# Altium schematic sheet Schematic_MuSSAP.SchDoc
size 420 x 297 mm; SheetNumber: 1; SheetTotal: 1
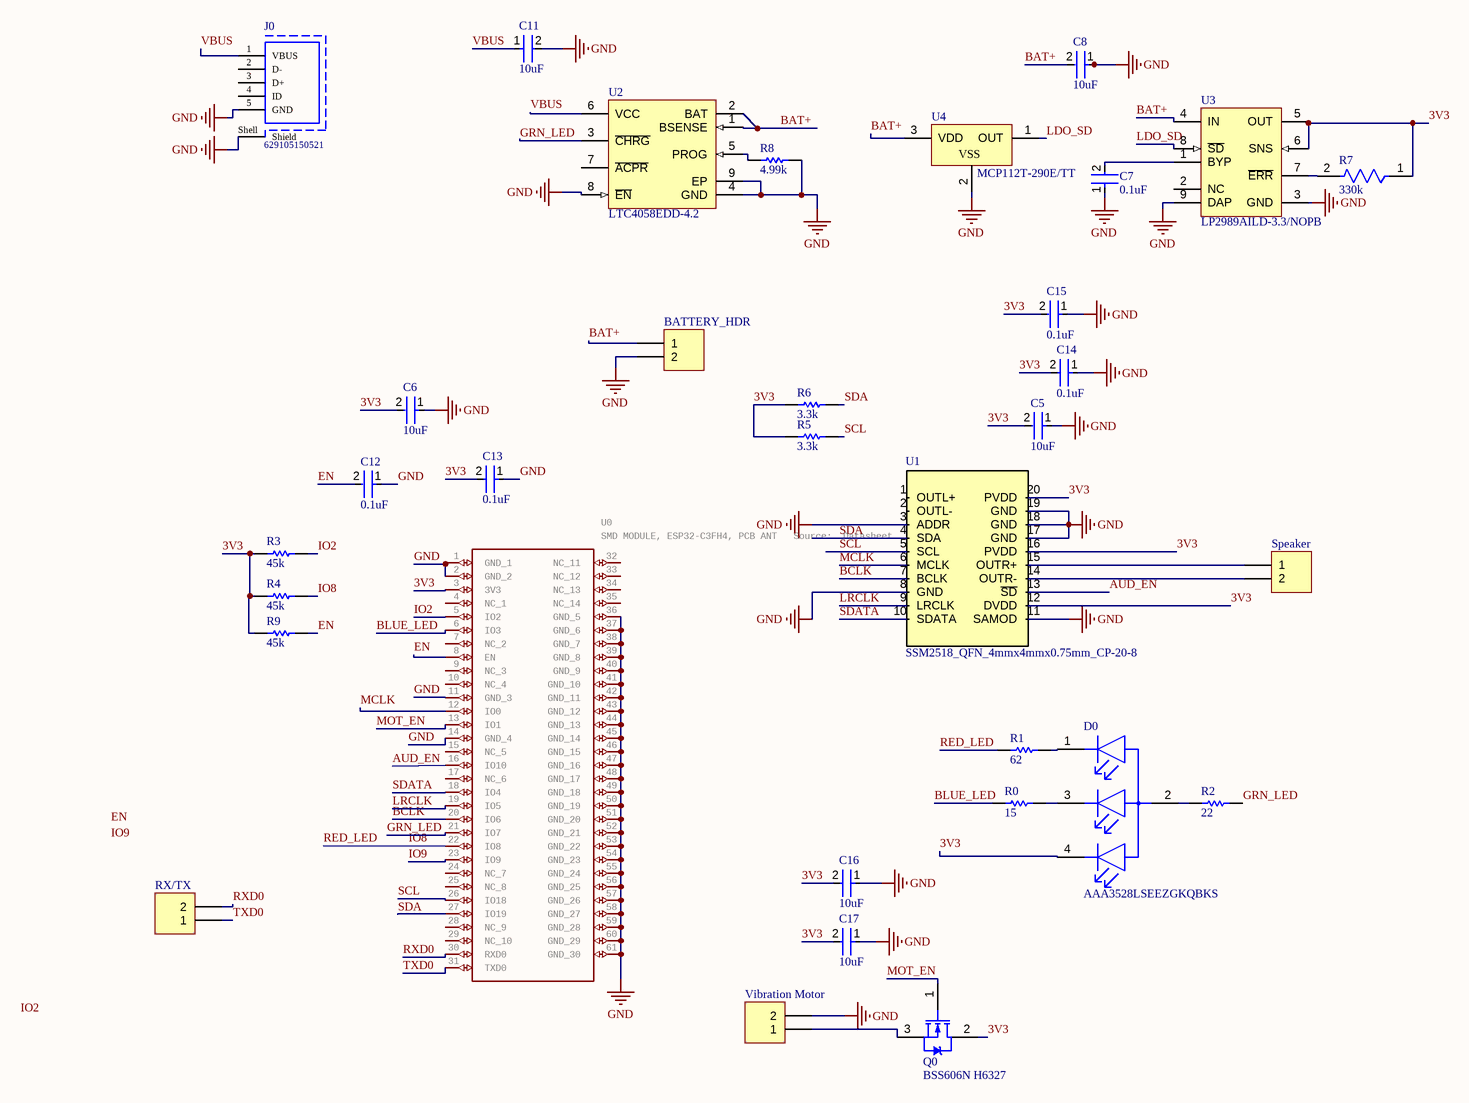
[diagram p0: Schematic_MuSSAP.SchDoc]

## Parts
BATTERY_HDR  (no value)  [HDR1X2]
C5  10uF  [FP-C0603-CG-IPC_B]
C6  10uF  [FP-C0603-CG-IPC_B]
C7  0.1uF  [FP-C0603-CG-IPC_B]
C8  10uF  [FP-C0603-CG-IPC_B]
C11  10uF  [FP-C0603-CG-IPC_B]
C12  0.1uF  [FP-C0603-CG-IPC_B]
C13  0.1uF  [FP-C0603-CG-IPC_B]
C14  0.1uF  [FP-C0603-CG-IPC_B]
C15  0.1uF  [FP-C0603-CG-IPC_B]
C16  10uF  [FP-C0603-CG-IPC_B]
C17  10uF  [FP-C0603-CG-IPC_B]
D0  AAA3528LSEEZGKQBKS  [FP-AAA3528LSEEZGKQBKS-MFG]
J0  629105150521  [629105150521]
Q0  BSS606N H6327  [INF-PG-SOT-89_N]
R0  15  [RESC1005X40X25LL05T10]
R1  62  [RESC1005X35X25ML10T10]
R2  22  [RESC1005X40X25LL05T10]
R3  45k  [RESC1005X35X25ML10T10]
R4  45k  [RESC1005X35X25ML10T10]
R5  3.3k  [RESC1005X35X25ML10T10]
R6  3.3k  [RESC1005X35X25ML10T10]
R7  330k  [FP-MCS0402-IPC_A]
R8  4.99k  [RESC1005X35X25ML10T10]
R9  45k  [RESC1005X35X25ML10T10]
RX/TX  (no value)  [HDR1X2]
Speaker  (no value)  [HDR1X2]
U0  SMD MODULE, ESP32-C3FH4, PCB ANT   Source:  Datasheet  [ESP32C3MINI1H4]
U1  SSM2518_QFN_4mmx4mmx0.75mm_CP-20-8  [QSSM2518_FN50P400X400X80_HS-21N]
U2  LTC4058EDD-4.2  [LT-DD-8_V]
U3  LP2989AILD-3.3/NOPB  [LDC08A]
U4  MCP112T-290E/TT  [SOT-23-TT3_M]
Vibration_Motor  (no value)  [HDR1X2]

## Nets
GND: BATTERY_HDR.2 C5.1 C6.1 C7.1 C8.1 C11.2 C12.1 C13.1 C14.1 C15.1 C16.1 C17.1 J0.5(GND) J0.Shell(Shield) R8.1 U0.1(GND_1) U0.2(GND_2) U0.11(GND_3) U0.14(GND_4) U0.36(GND_5) U0.37(GND_6) U0.38(GND_7) U0.39(GND_8) U0.40(GND_9) U0.41(GND_10) U0.42(GND_11) U0.43(GND_12) U0.44(GND_13) U0.45(GND_14) U0.46(GND_15) U0.47(GND_16) U0.48(GND_17) U0.49(GND_18) U0.50(GND_19) U0.51(GND_20) U0.52(GND_21) U0.53(GND_22) U0.54(GND_23) U0.55(GND_24) U0.56(GND_25) U0.57(GND_26) U0.58(GND_27) U0.59(GND_28) U0.60(GND_29) U0.61(GND_30) U1.3(ADDR) U1.8(GND) U1.11(SAMOD) U1.17(GND) U1.18(GND) U1.19(GND) U2.4(GND) U2.8(~{EN}) U2.9(EP) U3.3(GND) U3.9(DAP) U4.2(VSS) Vibration_Motor.2
3V3: C5.2 C6.2 C13.2 C14.2 C15.2 C16.2 C17.2 D0.4(BLUE_C) Q0.2(D) R3.1 R4.1 R5.1 R6.1 R7.1 R9.1 U0.3(3V3) U1.12(DVDD) U1.16(PVDD) U1.20(PVDD) U3.5(OUT) U3.6(SNS)
AUD_EN: U0.16(IO10) U1.13(~{SD})
BAT+: BATTERY_HDR.1 C8.2 U2.1(BSENSE) U2.2(BAT) U3.4(IN) U4.3(VDD)
BCLK: U0.20(IO6) U1.7(BCLK)
BLUE_LED: R0.1 U0.6(IO3)
EN: C12.2 R9.2 U0.8(EN)
GRN_LED: R2.2 U0.21(IO7) U2.3(~{CHRG})
IO2: R3.2 U0.5(IO2)
IO8: R1.1 R4.2 U0.22(IO8)  [also labelled RED_LED]
IO9: U0.23(IO9)
LDO_SD: U3.8(~{SD}) U4.1(OUT)
LRCLK: U0.19(IO5) U1.9(LRCLK)
MCLK: U0.12(IO0) U1.6(MCLK)
MOT_EN: Q0.1(G) U0.13(IO1)
RXD0: RX/TX.2 U0.30(RXD0)
SCL: R5.2 U0.26(IO18) U1.5(SCL)
SDA: R6.2 U0.27(IO19) U1.4(SDA)
SDATA: U0.18(IO4) U1.10(SDATA)
TXD0: RX/TX.1 U0.31(TXD0)
VBUS: C11.1 J0.1(VBUS) U2.6(VCC)
NetC7_2: C7.2 U3.1(BYP)
NetD0_1: D0.1(RED_C) R1.2
NetD0_2: D0.2(COMMON_ANODE) R2.1
NetD0_3: D0.3(GREEN_C) R0.2
NetQ0_3: Q0.3(S) Vibration_Motor.1
NetR7_2: R7.2 U3.7(~{ERR})
NetR8_2: R8.2 U2.5(PROG)
NetSpeaker_1: Speaker.1 U1.15(OUTR+)
NetSpeaker_2: Speaker.2 U1.14(OUTR-)

Not connected (* = marked no-connect by the designer): J0 2(D-) 3(D+) 4(ID); U0 4(NC_1) 7(NC_2) 9(NC_3) 10(NC_4) 15(NC_5) 17(NC_6) 24(NC_7) 25(NC_8) 28(NC_9) 29(NC_10) 32(NC_11) 33(NC_12) 34(NC_13) 35(NC_14); U1 1(OUTL+) 2(OUTL-); U2 7(~{ACPR}); U3 2(NC)

## Notes on the sheet
- Labels drawn without touching a wire or pin: EN, IO2, IO9
- THIS DOCUMENT AND THE DATA DISCLOSED HEREIN OR
- HEREWITH IS THE PROPERTY OF ALTIUM LIMITED AND MAY
- DWG NO:
- REVISION
- REV:
- DESCRIPTION
- DATE
- APPROVED
- BE FREELY DISTRIBUTED IN WHOLE. NO RIGHTS ARE
- RESERVED OR EXPRESS OR IMPLIED WARANTEE GIVEN.
- ENG:
- APPROVALS
- PROJECT
- DSN:
- CHK:
- REFERENCE DOCUMENTS
- PROJECT REVISION:
- TITLE
- DOCUMENT REVISION:
- DESIGN ITEM:
- BOM:
- FAB DWG:
- PCB DWG:
- ASSY DWG:
- SCALE:
- A3
- SIZE
- CAGE CODE
- FILE NAME
- DWG NO.
- SHEET
- OF
- REV

## Library data of the parts
BATTERY_HDR RX/TX Speaker Vibration_Motor = Header 2: Header, 2-Pin; LatestRevisionDate: 17-Jul-2002; LatestRevisionNote: Re-released for DXP Platform.; Publisher: Altium Limited
C5-C8 C11-C17 = CMP-2006-03069-2: CAP CER 0.1UF 25V Y5V 0603; Dissipation Factor: 7%; Capacitance: 100nF; Tolerance: 80%; Dielectric Material: Ceramic; Depth: 0.8mm; Voltage Rating (DC): 25V; Number of Pins: 2; Dielectric: Y5V; Lead Pitch: 0.7mm; Construction: Flat; Max Operating Temperature: 85°C; Voltage Rating: 25V; Lead Free: Lead Free; Case/Package: 0603; RoHS Compliant: Yes; Length: 1.6mm; Mount: Surface Mount; Thickness: 0.034inch; Radiation Hardening: No; Case Code (Metric): 1608; Packaging: Tape and Reel; Series: C; Package Quantity: 1; Height: 0.8mm; Min Operating Temperature: -30°C; Termination: SMD/SMT; Width: 0.031inch; Case Code (Imperial): 0603; REACH SVHC: No SVHC; Voltage: 25V
D0 = CMP-44529-000043-1: LED RGB CLEAR 4SMD; Dominant Wavelength: 465nm; Test Current: 2mA; Color: Blue; Forward Voltage: 2.7V; Viewing Angle: 120°; Luminous Intensity: 30mcd; Lens Color: Colorless; Case/Package: PLCC; Packaging: Tape and Reel; Number of Pins: 4; Width: 2.8mm; Lens Transparency: Clear; Mount: Surface Mount; Height: 2.1mm; Length: 3.2mm
J0 = CMP-1502-03252-1: Micro USB 2.0 Type B Receptacle WR-COM, Horizontal, SMT, with Pegs, High Current at Pin 1 & Pin 5; Manufacturer: Wurth Elektronik; Contact Resistance: 30mOhm; Rated Current: 3A; Working Voltage: 30VAC; Package Reference: 629105150521; Mounting Technology: SMT; Connector Type: MicroUSB2.0TypeB; Operating Temperature: -40to85degC; Orientation: Horizontal; Manufacturer URL: http://www.we-online.de; Datasheet URL: https://katalog.we-online.de/em/datasheet/629105150521.pdf; Part Number: 629105150521; Packaging: TapeandReel; Gender: Receptacle; Publisher: WurthElektronik
Q0 = CMP-1149-00049-1: OptiMOS-3 Small-Signal-Transistor, 60 V VDS, 3.2 A ID, PG-SOT-89, Reel, Green; Manufacturer: Infineon; VDS (max): 60 V; Green: TRUE; RDS (on) (max): 60 mOhm; Polarity: N; ID (max): 3.2Â A; PackageDescription: 3-Pin Small Outline Transistor Package, 4.5 x 2.5 mm Body, 1.5 mm Pitch; ComponentLink1URL: http://www.infineon.com/; PackageReference: PG-SOT-89; Halogen-free: TRUE; RevisionNote: Lost Devices pt2; Packing: Reel; ComponentLink3URL: http://www.infineon.com/cms/packages/SMD_-_Surface_Mounted_Devices/SOT/SOT089_xSC62x.html?__locale=en; ComponentLink1Description: Manufacturer URL; PartNumber: BSS606N H6327; DatasheetVersion: Rev. 2.2; ComponentLink2Description: Datasheet; Mounting Technology: Surface Mount; PackageVersion: Apr-08; ComponentLink2URL: http://www.infineon.com/dgdl/BSS606N_2.2.pdf?folderId=db3a3043156fd573011622e10b5c1f67&fileId=db3a30433dfcb54c013dfd4f43ed0120; ComponentLink3Description: Package Specification
R0 = CMP-2002-07413-1: Manufacturer: Yageo / Phycomp; Part Number: RC0402FR-0715RL
R1 R3-R6 R8 R9 = CMP-2002-02949-1: Part Number: RT0402BRD073KL; Manufacturer: Yageo
R2 = CMP-2002-07520-1: Manufacturer: Yageo / Phycomp; Part Number: RC0402FR-0722RL
R7 = CMP-02407-001123-1: RES SMD 1.2K OHM 1% 1/10W 0402; Max Power Dissipation: 100mW; Temperature Coefficient: 50ppm/°C; Resistance: 270kR; Contact Plating: Tin; Max Operating Temperature: 125°C; Min Operating Temperature: -55°C; Number of Terminations: 2; Military Standard: Not; Width: 0.02inch; Case/Package: 0402; Composition: Thin Film; Lead Free: Lead Free; Height: 0.015inch; Packaging: Tape and Reel; Length: 0.039inch; Package Quantity: 10000; Tolerance: 1%; Radiation Hardening: No; Depth: 0.5mm
U0 = ESP32-C3-MINI-1-H4: Manufacturer_Name: Espressif Systems; GateName_1: G$1; SymbolName_1: ESP32-C3-MINI-1-H4; LibraryName: ESP32-C3-MINI-1-H4; DeviceSetName: ESP32-C3-MINI-1-H4; Package: ESP32C3MINI1H4; Manufacturer_Part_Number: ESP32-C3-MINI-1-H4; Mouser_Part_Number: 356-ESP32-C3-MINI1H4; Mouser_Price-Stock: https://www.mouser.co.uk/ProductDetail/Espressif-Systems/ESP32-C3-MINI-1-H4?qs=stqOd1AaK78JkwNX13Q9hQ%3D%3D; Height: 2.55mm
U2 = CMP-0471-00145-1: Standalone Linear Li-Ion Battery Charger with Thermal Regulation, 4.25 to 6.5 V Vin, 8-pin SON (DD-8), -40 to 85 degC; Manufacturer: Linear Technology; Number of Cells: 1; Battery Chemistry: Li-Ion, Li-Polymer; Charge Termination: C/10; Vin Max(V): 6.5; Vin Min(V): 4.25; Max Charge Current(A): 0.95; Float Voltage: 4.2 V; PartNumber: LTC4058EDD-4.2; ComponentLink1Description: Manufacturer URL; Type of Charger: Linear; PackageVersion: Jun-10; ComponentLink3URL: http://cds.linear.com/docs/en/packaging/DFN_8_05-08-1698.pdf; RoHS: FALSE; Code_JEDEC: MO-229; PackageReference: DD-8; ComponentLink2URL: http://cds.linear.com/docs/en/datasheet/405842fs.pdf; Mounting Technology: Surface Mount; PackageDescription: 8-Pin Plastic DFN, Body 3 x 3 mm, Pitch 0.5 mm; ComponentLink1URL: http://www.linear.com/; ComponentLink2Description: Datasheet; ComponentLink3Description: Package Specification
U3 = CMP-0062-01460-2: Micropower/Low Noise, 500 mA Ultra Low-Dropout Regulator, 8-pin LLP, Pb-Free; Manufacturer: National Semiconductor; PackageTopMarking: NS*UZXYTT*L01JA; PowerWise: N; CompType: LDO IC; PackageDescription: LLP, Plastic, Dual, 4 x 4 x 0.75mm Body, 8 Lead, 0.8mm Pitch; ComponentLink2URL: http://www.national.com/pf/LP/LP2989.html; RoHS: Y; DatasheetVersion: Feb-2005; ComponentLink3URL: http://www.national.com/packaging/folders/ldc08a.html; ComponentLink1Description: LP2989 Datasheet; PackageVersion: revB, Jun-2003; RevisionNote: Component URLs added; ComponentLink1URL: http://www.national.com/ds/LP/LP2989.pdf; ComponentLink2Description: LP2989 Web Page; PackageReference: LDC08A; PinCount: 8; ComponentLink3Description: LDC08A Package Page
U4 = CMP-0130-00041-1: 1.75Î¼A Micropower Voltage Detector, Push-Pull Output, 2.90V, 3-Pin SOT-23, Extended Temperature, Tape and Reel; PackageVersion: revBB, Aug-2009; DatasheetVersion: revD, Jun-2005; PackageDescription: 3-Lead Plastic Small Outline Transistor (TT) [SOT-23]; Code_IPC: SOT23-3; PackageReference: SOT-23-TT3